# EAGLE design Nokia 1202 breakout (EAGLE 6.2)
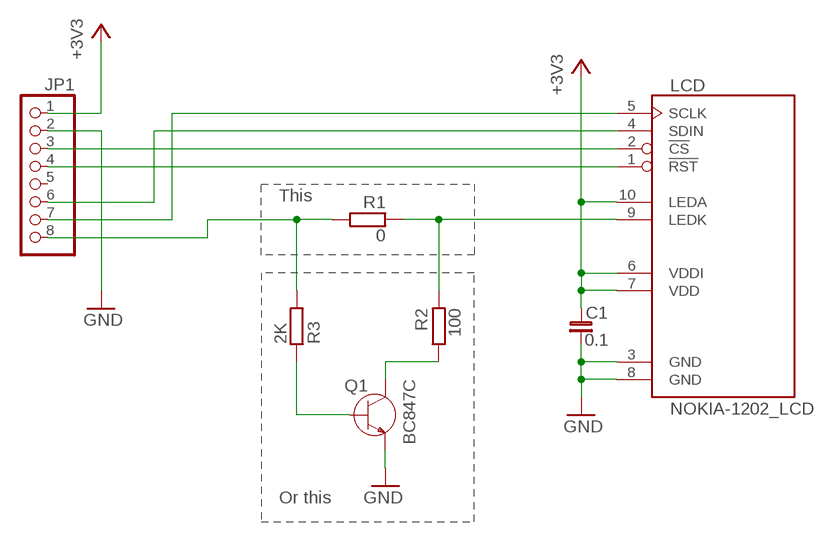
[diagram p0: schematic, sheet 1]

## Parts
C1  0.1  C_0805  [C0805]
JP1  PINHD-1X8  [1X08]
LCD  NOKIA-1202_LCD  [NOKIA-1202_LCD]
Q1  BC847C  [SOT23]
R1  0  R_0805  [R0805]
R2  100  R_0805  [R0805]
R3  2K  R_0805  [R0805]

## Nets
+3V3: C1.1 JP1.1 LCD.6(VDDI) LCD.7(VDD) LCD.10(LEDA)
BL: JP1.8 R1.2 R3.2
GND: C1.2 JP1.2 LCD.3(GND) LCD.8(GND) Q1.2(E)
MOSI: JP1.6 LCD.4(SDIN)
N$1: JP1.3 LCD.2(!CS)
N$2: JP1.4 LCD.1(!RST)
N$8: LCD.9(LEDK) R1.1 R2.1
N$9: Q1.1(B) R3.1
N$10: Q1.3(C) R2.2
SCLK: JP1.7 LCD.5(SCLK)
Unconnected: JP1.5

## Notes on the sheet
- This
- Or this

## Library data of the parts
C1 = rc-master-smd:C_: NON-POLARIZED CAP
JP1 = pinhead:PINHD-1X8: PIN HEADER
LCD = Catmacey:NOKIA-1202_LCD
Q1 = semiconductor:BC847: Bipolar transistor NPN-structure
R1-R3 = rc-master-smd:R_: RESISTOR

## Board
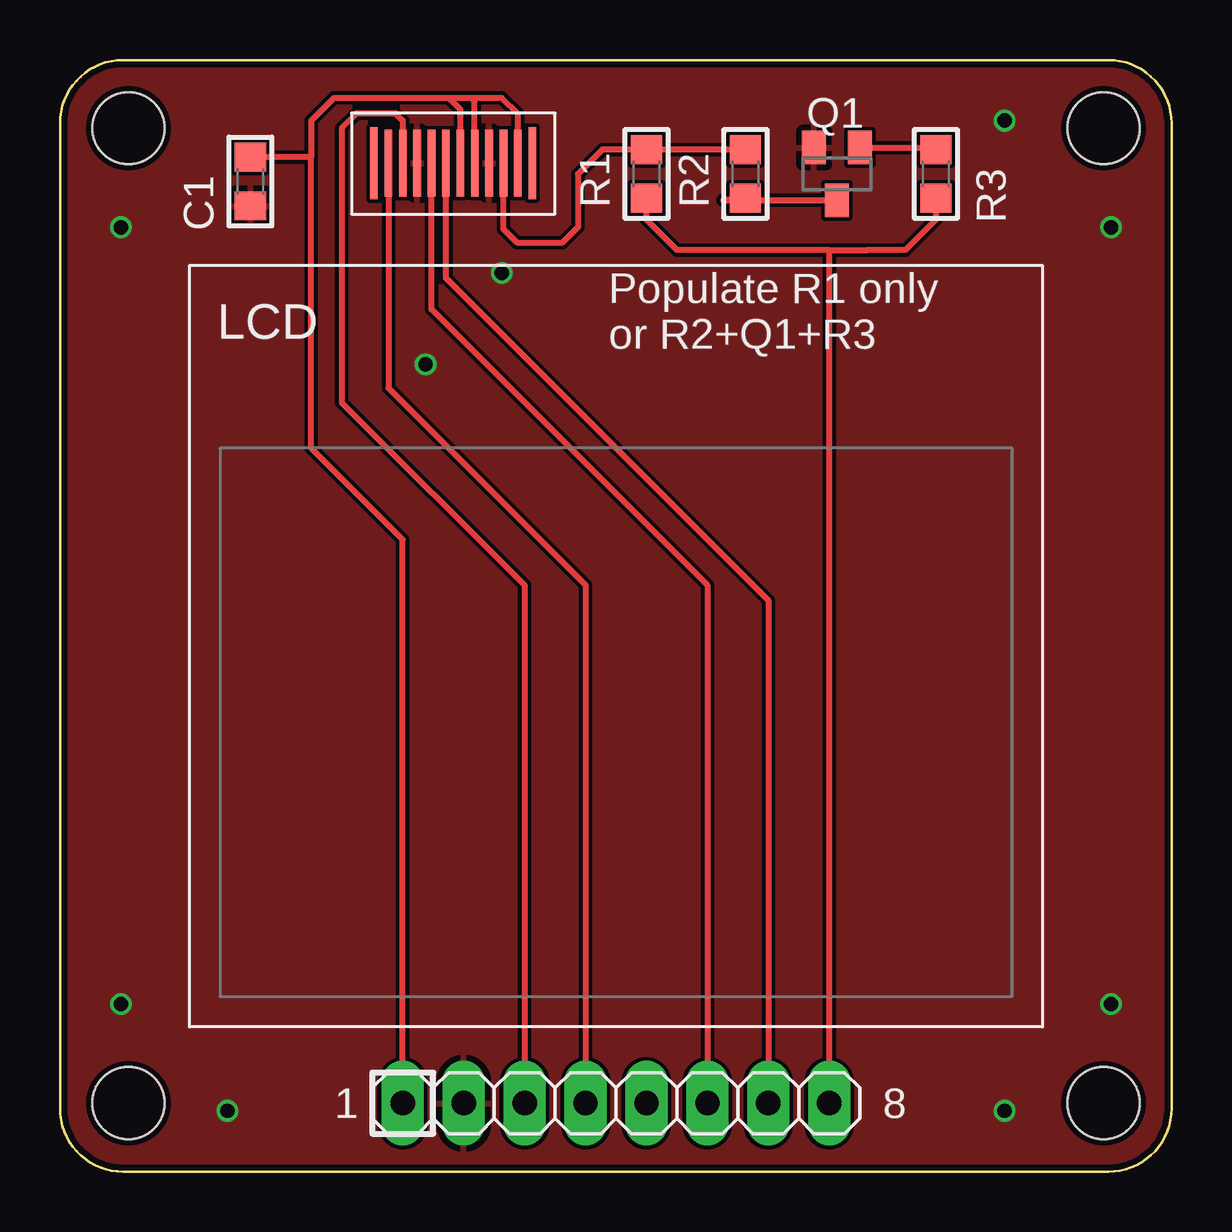
[diagram p1: board, top side]
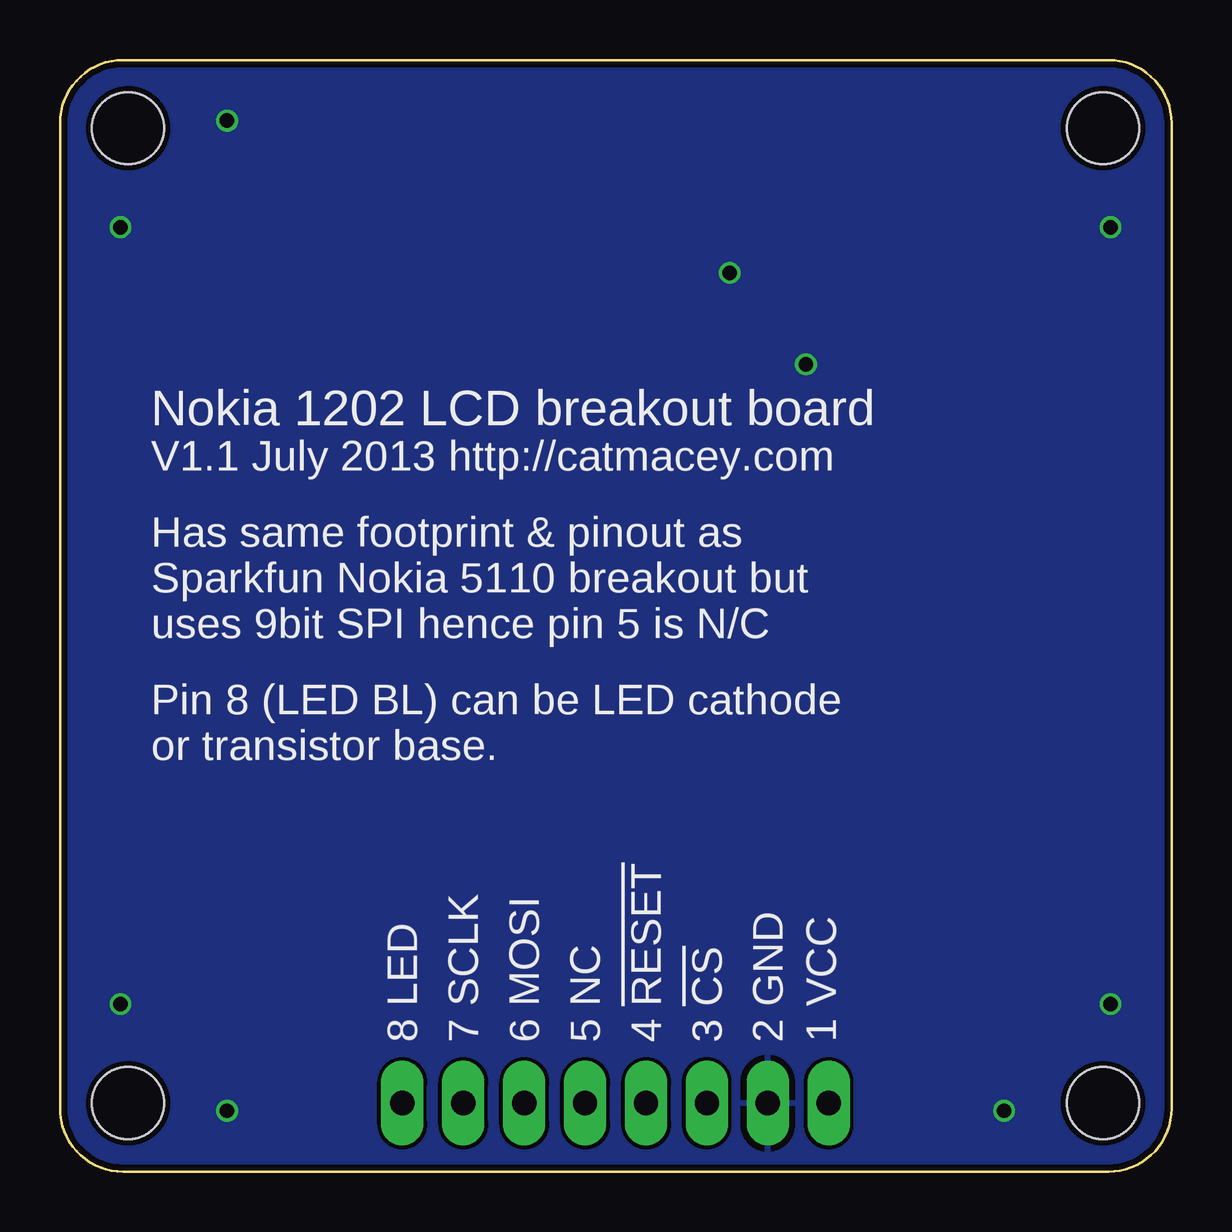
[diagram p2: board, bottom side, seen from below]

Size 46.34 x 46.34 mm. Coordinates in mm from the lower left corner, seen from the top.
Outline: 0,43.71 0,2.63 arc90 2.63,0 43.7,0 arc90 46.34,2.63 46.34,43.71 arc90 43.7,46.34 2.63,46.34 arc90 0,43.71
Copper layers (1*16): Top 0.035mm / dielectric 1.5mm / Bottom 0.035mm
Design rules: minimum track width 6mil, minimum drill 12mil, track to track 6mil, track to pad 6mil, pad to pad 6mil, via to via 6mil, smd to smd 0mil, copper to edge 10mil, drill to drill 10mil, minimum pad ring 15mil, minimum via ring 6mil, stop-mask expansion 2mil, vias tented up to drill 100mil, thermal gap 10mil
Holes 3 mm at 2.86,43.5 43.5,43.5 43.5,2.86 2.86,2.86

### Footprints (pad centres in the part's own frame; a part is rotated, then mirrored left to right if it is on the bottom)
C0805 = smd 1.2 x 1.3: 1 -1.016,0; 2 1.016,0
1X08 = drill 1.016 long: 1 -8.89,0; 2 -6.35,0; 3 -3.81,0; 4 -1.27,0; 5 1.27,0; 6 3.81,0; 7 6.35,0; 8 8.89,0
NOKIA-1202_LCD = smd 0.32 x 3: 0 -10.09,22.044; 11 -3.49,22.044 | smd 0.32 x 2.8: 1 -9.49,22.044; 2 -8.89,22.044; 3 -8.29,22.044; 4 -7.69,22.044; 5 -7.09,22.044; 6 -6.49,22.044; 7 -5.89,22.044; 8 -5.29,22.044; 9 -4.69,22.044; 10 -4.09,22.044
SOT23 = smd 1 x 1.4: 1 -0.95,-1.1; 2 0.95,-1.1; 3 0,1.1
R0805 = smd 1.2 x 1.3: 1 -1.016,0; 2 1.016,0

### Placement (x,y rotation side)
C1  7.94,41.27 270 top
JP1  23.18,2.86 0 top
LCD  23.18,20 0 top
Q1  32.38,41.59 180 top
R1  24.45,41.59 270 top
R2  28.57,41.59 270 top
R3  36.51,41.59 270 top

### Tracks (layer width: path | path; a pad name or v marks a point on that pad's centre or on a via)
+3V3
  Top 0.254: JP1.1 14.29,26.35 10.48,30.16 10.48,42.29 | 16.19,44.77 11.43,44.77 10.48,43.81 10.48,42.29 | 16.19,44.77 17.14,44.77 | 17.14,44.77 18.41,44.77 19.09,44.09 LCD.10 | 10.48,42.29 C1.1 | LCD.6 16.69,44.27 16.19,44.77 | LCD.7 17.29,44.62 17.14,44.77
BL
  Top 0.254: 32.07,38.42 25.72,38.42 24.45,39.69 R1.2 | R3.2 36.51,39.69 35.24,38.42 33.66,38.42 32.07,38.42 | JP1.8 32.07,38.42
GND  (via drill 0.6)
  other vias: 15.24,33.66 18.41,37.47 2.54,6.99 6.99,2.54 39.37,2.54 43.81,6.99 2.54,39.37 39.37,43.81 43.81,39.37
  pour Top: 0,0 0,43.72 arc-90 2.63,46.35 46.35,46.35 46.35,2.63 arc-90 43.72,0
  pour Bottom: 0,46.35 46.35,46.35 46.35,0 0,0
MOSI
  Top 0.254: JP1.6 26.99,24.45 15.49,35.95 LCD.4
N$1
  Top 0.254: JP1.3 19.37,24.45 11.75,32.07 11.75,43.5 12.38,44.13 13.97,44.13 14.29,43.81 LCD.2
N$2
  Top 0.254: LCD.1 13.69,32.67 21.91,24.45 JP1.4
N$8
  Top 0.254: R2.1 R1.1 22.61,42.61 21.59,41.59 21.59,39.37 20.95,38.73 19.05,38.73 18.49,39.3 LCD.9
N$9
  Top 0.254: Q1.1 36.43,42.69 R3.1
N$10
  Top 0.254: R2.2 27.64,40.49 Q1.3
SCLK
  Top 0.254: JP1.7 29.53,23.81 16.09,37.25 LCD.5

### Text on the board
tPlace: Populate R1 only | or R2+Q1+R3 | 1 | 8
bPlace: Nokia 1202 LCD breakout board | V1.1 July 2013 http://catmacey.com | Has same footprint & pinout as | Sparkfun Nokia 5110 breakout but | uses 9bit SPI hence pin 5 is N/C | Pin 8 (LED BL) can be LED cathode | or transistor base. | 1 VCC | 2 GND | 3 !CS | 4 !RESET | 5 NC | 6 MOSI | 7 SCLK | 8 LED